# EAGLE design pbc (EAGLE 9.6.2)
CHECKED_BY: -; DRAWN_BY: Andreas Zapfl; REV: 1.0; TITLE: Business Card
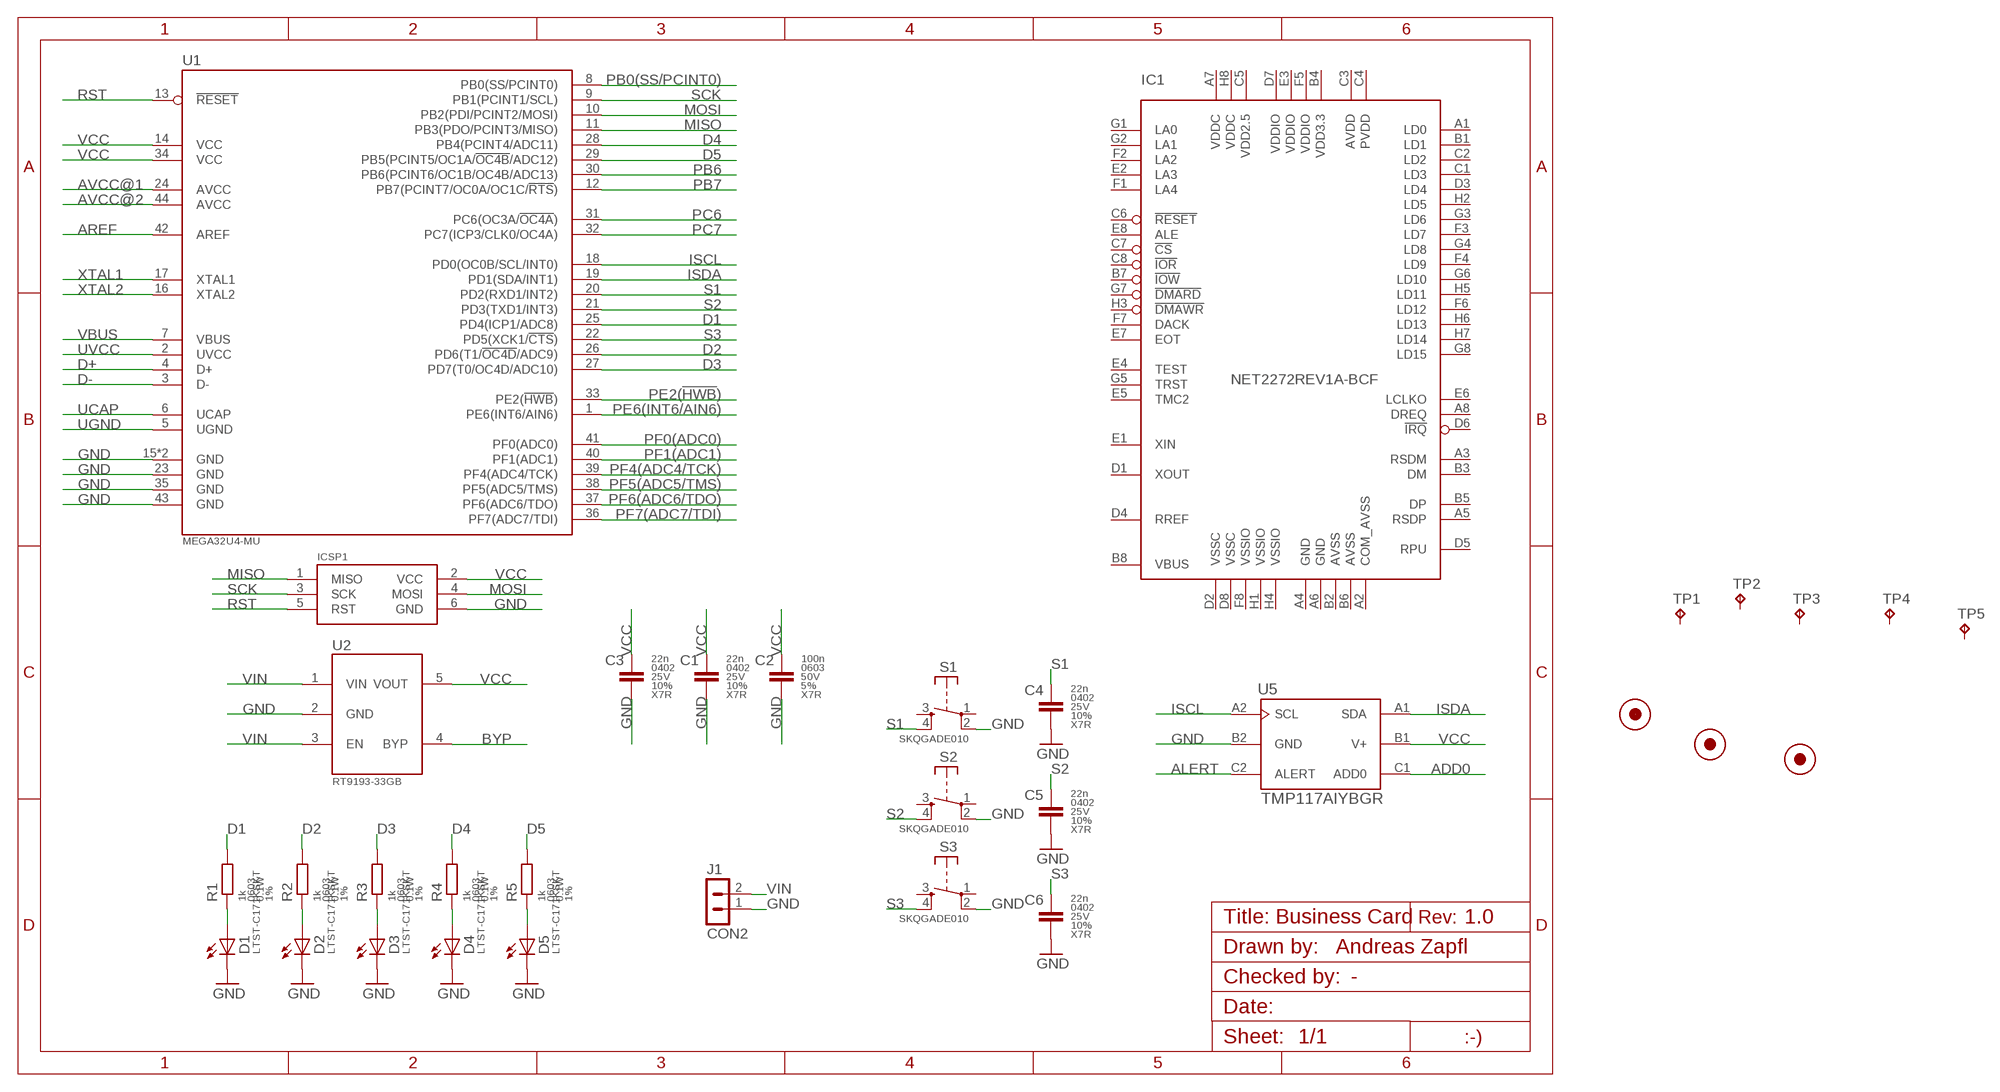
[diagram p0: schematic, sheet 1]

## Parts
C1  22n  22NF-0402-25V-10%  [C0402]
C2  100n  100NF-0603-50V-5%  [C0603]
C3  22n  22NF-0402-25V-10%  [C0402]
C4  22n  22NF-0402-25V-10%  [C0402]
C5  22n  22NF-0402-25V-10%  [C0402]
C6  22n  22NF-0402-25V-10%  [C0402]
D1  LTST-C171KSKT  [CHIPLED_0805]
D2  LTST-C171KSKT  [CHIPLED_0805]
D3  LTST-C171KSKT  [CHIPLED_0805]
D4  LTST-C171KSKT  [CHIPLED_0805]
D5  LTST-C171KSKT  [CHIPLED_0805]
FD1  FIDUCIAL  [FIDUCIAL_1MM]
FD2  FIDUCIAL  [FIDUCIAL_1MM]
FD3  FIDUCIAL  [FIDUCIAL_1MM]
IC1  NET2272REV1A-BCF  [FBGA64]
ICSP1  AVR-ISP-SKEDD  [490107670612_DEBUGGING]
J1  CON2  [H2-2.54]
R1  1k  1KOHM-0603-1/10W-1%  [R0603]
R2  1k  1KOHM-0603-1/10W-1%  [R0603]
R3  1k  1KOHM-0603-1/10W-1%  [R0603]
R4  1k  1KOHM-0603-1/10W-1%  [R0603]
R5  1k  1KOHM-0603-1/10W-1%  [R0603]
S1  SKQGADE010  [TACTILE_SWITCH_SMD_5.2MM]
S2  SKQGADE010  [TACTILE_SWITCH_SMD_5.2MM]
S3  SKQGADE010  [TACTILE_SWITCH_SMD_5.2MM]
TP1  TP-B0.635  [B0.635]
TP2  TP-B0.635  [B0.635]
TP3  TP-B0.635  [B0.635]
TP4  TP-B0.635  [B0.635]
TP5  TP-B0.635  [B0.635]
U1  MEGA32U4-MU  [TQFN44_7MM]
U2  RT9193-33GB  [SOT23-5]
U5  TMP117AIYBGR  [TMP117AIYBGR]

## Nets
ADD0: U5.C1(ADD0)
ALERT: U5.C2(ALERT)
AREF: U1.42(AREF)
AVCC@1: U1.24(AVCC)
AVCC@2: U1.44(AVCC)
BYP: U2.4(BYP)
D1: R1.2 U1.25(PD4(ICP1/ADC8))
D2: R2.2 U1.26(PD6(T1/!OC4D!/ADC9))
D3: R3.2 U1.27(PD7(T0/OC4D/ADC10))
D4: R4.2 U1.28(PB4(PCINT4/ADC11))
D5: R5.2 U1.29(PB5(PCINT5/OC1A/!OC4B!/ADC12))
D+: U1.4(D+)
D-: U1.3(D-)
GND: C1.2 C2.2 C3.2 C4.2 C5.2 C6.2 D1.C D2.C D3.C D4.C D5.C ICSP1.6(GND) J1.1 S1.2(P) S2.2(P) S3.2(P) U1.15(GND) U1.23(GND) U1.35(GND) U1.43(GND) U1.EXP(GND) U2.2(GND) U5.B2(GND)
ISCL: U1.18(PD0(OC0B/SCL/INT0)) U5.A2(SCL)
ISDA: U1.19(PD1(SDA/INT1)) U5.A1(SDA)
MISO: ICSP1.1(MISO) U1.11(PB3(PDO/PCINT3/MISO))
MOSI: ICSP1.4(MOSI) U1.10(PB2(PDI/PCINT2/MOSI))
N$1: D1.A R1.1
N$2: D2.A R2.1
N$3: D3.A R3.1
N$4: D4.A R4.1
N$5: D5.A R5.1
PB0(SS/PCINT0): U1.8(PB0(SS/PCINT0))
PB6: U1.30(PB6(PCINT6/OC1B/OC4B/ADC13))
PB7: U1.12(PB7(PCINT7/OC0A/OC1C/!RTS!))
PC6: U1.31(PC6(OC3A/!OC4A!))
PC7: U1.32(PC7(ICP3/CLK0/OC4A))
PE2(!HWB!): U1.33(PE2(!HWB!))
PE6(INT6/AIN6): U1.1(PE6(INT6/AIN6))
PF0(ADC0): U1.41(PF0(ADC0))
PF1(ADC1): U1.40(PF1(ADC1))
PF4(ADC4/TCK): U1.39(PF4(ADC4/TCK))
PF5(ADC5/TMS): U1.38(PF5(ADC5/TMS))
PF6(ADC6/TDO): U1.37(PF6(ADC6/TDO))
PF7(ADC7/TDI): U1.36(PF7(ADC7/TDI))
RST: ICSP1.5(RST) U1.13(!RESET!)
S1: C4.1 S1.4(S) U1.20(PD2(RXD1/INT2))
S2: C5.1 S2.4(S) U1.21(PD3(TXD1/INT3))
S3: C6.1 S3.4(S) U1.22(PD5(XCK1/!CTS!))
SCK: ICSP1.3(SCK) U1.9(PB1(PCINT1/SCL))
UCAP: U1.6(UCAP)
UGND: U1.5(UGND)
UVCC: U1.2(UVCC)
VBUS: U1.7(VBUS)
VCC: C1.1 C2.1 C3.1 ICSP1.2(VCC) U1.14(VCC) U1.34(VCC) U2.5(VOUT) U5.B1(V+)
VIN: J1.2 U2.1(VIN) U2.3(EN)
XTAL1: U1.17(XTAL1)
XTAL2: U1.16(XTAL2)
Unconnected: IC1.A1(LD0) IC1.A3(RSDM) IC1.A5(RSDP) IC1.A8(DREQ) IC1.B1(LD1) IC1.B3(DM) IC1.B5(DP) IC1.B7(!IOW) IC1.B8(VBUS) IC1.C1(LD3) IC1.C2(LD2) IC1.C6(!RESET) IC1.C7(!CS) IC1.C8(!IOR) IC1.D1(XOUT) IC1.D3(LD4) IC1.D4(RREF) IC1.D5(RPU) IC1.D6(!IRQ) IC1.E1(XIN) IC1.E2(LA3) IC1.E4(TEST) IC1.E5(TMC2) IC1.E6(LCLKO) IC1.E7(EOT) IC1.E8(ALE) IC1.F1(LA4) IC1.F2(LA2) IC1.F3(LD7) IC1.F4(LD9) IC1.F6(LD12) IC1.F7(DACK) IC1.G1(LA0) IC1.G2(LA1) IC1.G3(LD6) IC1.G4(LD8) IC1.G5(TRST) IC1.G6(LD10) IC1.G7(!DMARD) IC1.G8(LD15) IC1.H2(LD5) IC1.H3(!DMAWR) IC1.H5(LD11) IC1.H6(LD13) IC1.H7(LD14) S1.1(P) S1.3(S) S2.1(P) S2.3(S) S3.1(P) S3.3(S) TP1.TP TP2.TP TP3.TP TP4.TP TP5.TP

## Power pins joined to a net without a drawn wire
AVDD: IC1.C3(AVDD)
AVSS: IC1.B2(AVSS) IC1.B6(AVSS)
COM_AVSS: IC1.A2(COM_AVSS)
GND: IC1.A4(GND) IC1.A6(GND)
PVDD: IC1.C4(PVDD)
VDD2.5: IC1.C5(VDD2.5)
VDD3.3: IC1.B4(VDD3.3)
VDDC: IC1.A7(VDDC) IC1.H8(VDDC)
VDDIO: IC1.D7(VDDIO) IC1.E3(VDDIO) IC1.F5(VDDIO)
VSSC: IC1.D2(VSSC) IC1.D8(VSSC)
VSSIO: IC1.F8(VSSIO) IC1.H1(VSSIO) IC1.H4(VSSIO)

## Library data of the parts
C1 C3-C6 = zaan-Capacitors:22NF: 22nF capacitor; DESCRIPTION: Chip Capacitor; DIELECTRIC: X7R; MF: Wurth Electronics; MPN: 885012205052; PACKAGE: 1005; PACKAGE-IN: 0402; TOLERANCE: 10%; VOLTAGE: 25V
C2 = zaan-Capacitors:100NF: 100nF capacitor; DESCRIPTION: Chip Capacitor; DIELECTRIC: X7R; MF: Yageo; MPN: CC0603JRX7R9BB104; PACKAGE: 1606; PACKAGE-IN: 0603; TOLERANCE: 5%; VOLTAGE: 50V
D1-D5 = zaan-Optoelectronics:LTST: SMD LED Footprint: 0805 Source: Datasheet <http://optoelectronics.liteon.com/upload/download/ds22-2000-110/ltst-c171kskt.pdf> Manufacturer: Lite-On; DESCRIPTION: Surface Mount LED; MF: Lite-On; MPN: LTST-C171KSKT; PACKAGE: 2012; PACKAGE-IN: 0805
FD1-FD3 = EET-Symbols:FIDUCIAL: For use by pick and place machines to calibrate the vision/machine, 1mm
IC1 = plxtech:NET2272: NET2272 USB 2.0 Peripheral Controller Source: http://www.plxtech.com/dts/download.asp?f=NET2000/2272/Net2272.spec.re040615.pdf FBGA-Type: http://www1.plxtech.com/TEMP/77131/NET2272r1A_data_book_v1.92_31Oct05.pdf; OC_FARNELL: unknown; OC_NEWARK: unknown
ICSP1 = zaan-Connectors:AVR-ISP
J1 = zaan-Retired:CON2
R1-R5 = zaan-Resistors:1KOHM: 1kΩ resistor; DESCRIPTION: Chip Resistor; MF: Yageo; MPN: RC0603FR-071KL; PACKAGE: 1608; PACKAGE-IN: 0603; POWER: 0.1W; TOLERANCE: 1%; VOLTAGE: 75V
S1-S3 = zaan-Electromechanical:SKQGADE010
TP1-TP5 = EET-No-Category:TP
U1 = zaan-IC-Microcontroller:MEGA32U4: ATmega32u4 8-bit Microcontroller with 16/32K bytes of ISP Flash and USB Controller Footprint: QFN-44 Source: Datasheet <http://ww1.microchip.com/downloads/en/devicedoc/atmel-7766-8-bit-avr-atmega16u4-32u4_datasheet.pdf> Manufacturer: Atmel; DESCRIPTION: Microcontroller; MF: Atmel; MPN: ATMEGA32U4-MU; PACKAGE: QFN-44
U2 = zaan-IC-Power:RT9193: LDO Regulator 300mA, Ultra-Low Noise, Ultra-Fast CMOS LDO Regulator Footprint: SOT-23-5 Source: Datasheet <https://www.richtek.com/assets/product_file/RT9193/DS9193-16.pdf> Manufacturer: Richtek; DESCRIPTION: Low Dropout Regulator; MF: Richtek; MPN: RT9193-33GB; PACKAGE: SOT-23-5
U5 = Sensor:TMP117AIYBGR: TEMP SENSOR Manufacturer's datasheet <http://www.ti.com/lit/ds/symlink/tmp117.pdf>; CREATED_BY: PCBLayout.com; DIGIKEY_PART_NUMBER: 296-TMP117AIYBGRDKR-ND; MANUFACTURER: Texas Instruments; MPN: TMP117AIYBGR; PACKAGE: 6-DSBGA

## Board
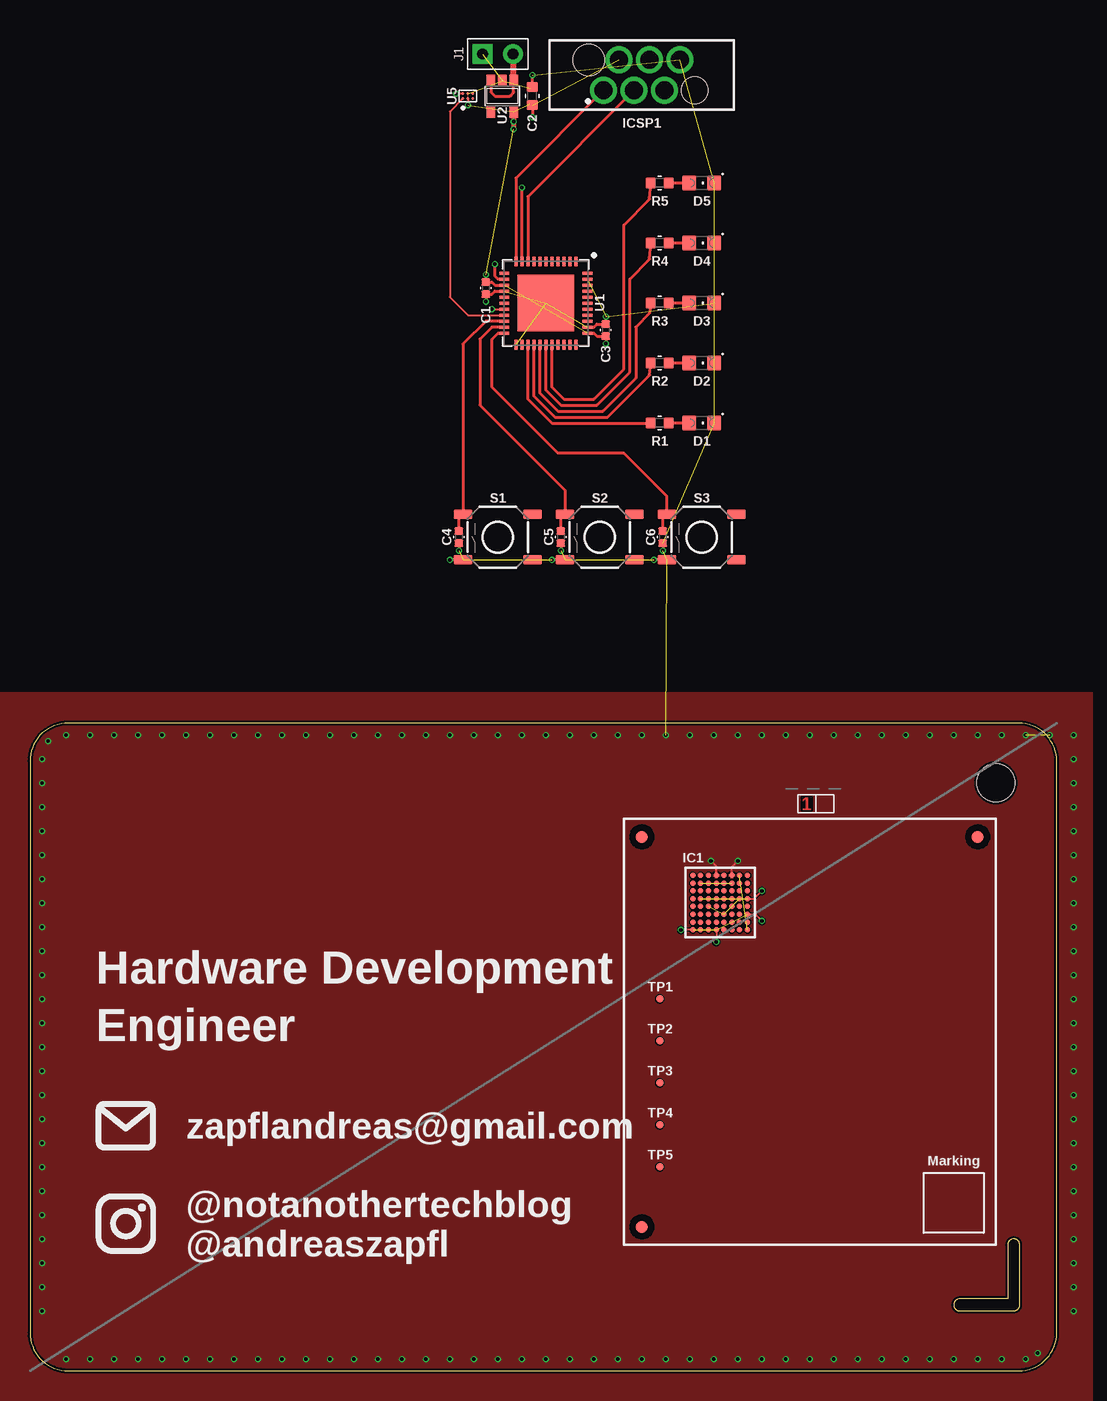
[diagram p1: board, top side]
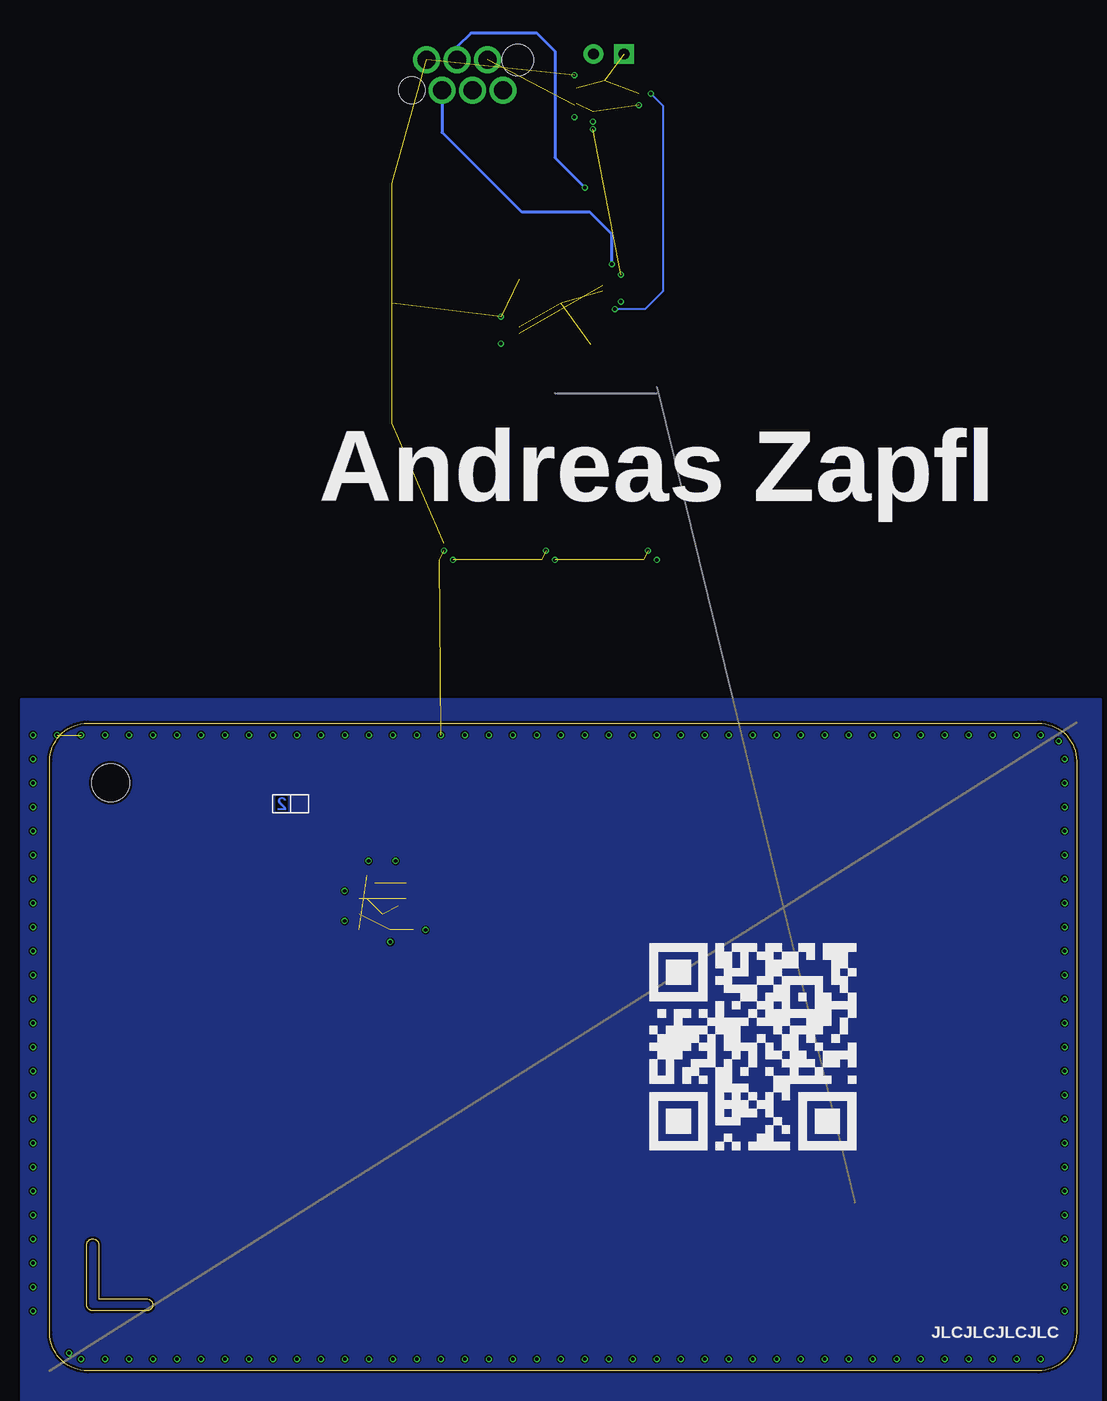
[diagram p2: board, bottom side, seen from below]

Size 85.6 x 53.98 mm. Coordinates in mm from the lower left corner, seen from the top.
Outline: 0,50.8 0,3.17 arc90 3.17,0 82.42,0 arc90 85.6,3.17 85.6,50.8 arc90 82.42,53.98 3.17,53.98 arc90 0,50.8
Outline: 77.52,6 arc180 77.52,5 82.02,5 arc90 82.52,5.5 82.52,10.5 arc180 81.52,10.5 81.52,6 77.52,6
Copper layers (1*16): Top 0.035mm / dielectric 1.44mm / Bottom 0.035mm
Design rules "Multi-CB_4L_EET *": minimum track width 0.1mm, minimum drill 0.2mm, track to track 0.1mm, track to pad 0.1mm, pad to pad 0.1mm, via to via 0.1mm, smd to smd 0mil, copper to edge 0.2mm, drill to drill 0.2mm, minimum pad ring 0.125mm, minimum via ring 0.1mm, stop-mask expansion 2mil, vias tented up to drill 0.45mm, thermal gap 0.2mm
Holes 3.17 mm at 80.52,49

### Footprints (pad centres in the part's own frame; a part is rotated, then mirrored left to right if it is on the bottom)
C0402 = smd 0.62 x 0.72: 1 -0.5,0; 2 0.5,0
C0603 = smd 0.85 x 0.95: 1 -0.75,0; 2 0.75,0
CHIPLED_0805 = smd 1.2 x 1.2: A 0,-1.05; C 0,1.05
FIDUCIAL_1MM = smd 1 x 1: 1 0,0
FBGA64 = smd 0.45 x 0.45: A1 -2.275,2.275; A2 -1.625,2.275; A3 -0.975,2.275; A4 -0.325,2.275; A5 0.325,2.275; A6 0.975,2.275; A7 1.625,2.275; A8 2.275,2.275; B1 -2.275,1.625; B2 -1.625,1.625; B3 -0.975,1.625; B4 -0.325,1.625; B5 0.325,1.625; B6 0.975,1.625; B7 1.625,1.625; B8 2.275,1.625; C1 -2.275,0.975; C2 -1.625,0.975; C3 -0.975,0.975; C4 -0.325,0.975; C5 0.325,0.975; C6 0.975,0.975; C7 1.625,0.975; C8 2.275,0.975; D1 -2.275,0.325; D2 -1.625,0.325; D3 -0.975,0.325; D4 -0.325,0.325; D5 0.325,0.325; D6 0.975,0.325; D7 1.625,0.325; D8 2.275,0.325; E1 -2.275,-0.325; E2 -1.625,-0.325; E3 -0.975,-0.325; E4 -0.325,-0.325; E5 0.325,-0.325; E6 0.975,-0.325; E7 1.625,-0.325; E8 2.275,-0.325; F1 -2.275,-0.975; F2 -1.625,-0.975; F3 -0.975,-0.975; F4 -0.325,-0.975; F5 0.325,-0.975; F6 0.975,-0.975; F7 1.625,-0.975; F8 2.275,-0.975; G1 -2.275,-1.625; G2 -1.625,-1.625; G3 -0.975,-1.625; G4 -0.325,-1.625; G5 0.325,-1.625; G6 0.975,-1.625; G7 1.625,-1.625; G8 2.275,-1.625; H1 -2.275,-2.275; H2 -1.625,-2.275; H3 -0.975,-2.275; H4 -0.325,-2.275; H5 0.325,-2.275; H6 0.975,-2.275; H7 1.625,-2.275; H8 2.275,-2.275
490107670612_DEBUGGING = drill 1.5 pad 1.825: 1 3.175,1.27; 2 1.905,-1.27; 3 0.635,1.27; 4 -0.635,-1.27; 5 -1.905,1.27; 6 -3.175,-1.27 | hole 2.2: -4.405,1.27 | hole 2.6: 4.405,-1.27
H2-2.54 = drill 0.889 pad 1.651 square: 1 0,1.27 | drill 0.889 pad 1.651: 2 0,-1.27
R0603 = smd 0.85 x 0.95: 1 -0.75,0; 2 0.75,0
TACTILE_SWITCH_SMD_5.2MM = smd 1.524 x 0.762: 1 -2.9,1.905; 2 2.9,1.905; 3 -2.9,-1.905; 4 2.9,-1.905
B0.635 = smd 0.635 x 0.635: TP 0,0
TQFN44_7MM = smd 0.8 x 0.25: 1 -3.475,2.5; 2 -3.475,2; 3 -3.475,1.5; 4 -3.475,1; 5 -3.475,0.5; 6 -3.475,0; 7 -3.475,-0.5; 8 -3.475,-1; 9 -3.475,-1.5; 10 -3.475,-2; 11 -3.475,-2.5; 23 3.475,-2.5; 24 3.475,-2; 25 3.475,-1.5; 26 3.475,-1; 27 3.475,-0.5; 28 3.475,0; 29 3.475,0.5; 30 3.475,1; 31 3.475,1.5; 32 3.475,2; 33 3.475,2.5 | smd 0.25 x 0.8: 12 -2.5,-3.475; 13 -2,-3.475; 14 -1.5,-3.475; 15 -1,-3.475; 16 -0.5,-3.475; 17 0,-3.475; 18 0.5,-3.475; 19 1,-3.475; 20 1.5,-3.475; 21 2,-3.475; 22 2.5,-3.475; 34 2.5,3.475; 35 2,3.475; 36 1.5,3.475; 37 1,3.475; 38 0.5,3.475; 39 0,3.475; 40 -0.5,3.475; 41 -1,3.475; 42 -1.5,3.475; 43 -2,3.475; 44 -2.5,3.475 | smd 4.7 x 4.7: EXP 0,0
SOT23-5 = smd 0.69 x 0.99: 1 -0.95,-1.29; 2 0,-1.29; 3 0.95,-1.29; 4 0.95,1.3; 5 -0.95,1.3
TMP117AIYBGR = smd 0.23 x 0.23: A1 -0.2,0.4; A2 0.2,0.4; B1 -0.2,0; B2 0.2,0; C1 -0.2,-0.4; C2 0.2,-0.4

### Placement (x,y rotation side)
C1  38,90.23 270 top  (outside the outline)
C2  41.88,106.23 90 top  (outside the outline)
C3  48,86.73 90 top  (outside the outline)
C4  35.75,69.48 270 top  (outside the outline)
C5  44.25,69.48 270 top  (outside the outline)
C6  52.75,69.48 270 top  (outside the outline)
D1  56,78.98 270 top  (outside the outline)
D2  56,83.98 270 top  (outside the outline)
D3  56,88.98 270 top  (outside the outline)
D4  56,93.98 270 top  (outside the outline)
D5  56,98.98 270 top  (outside the outline)
FD1  51.02,44.5 90 top
FD2  79.02,44.5 90 top
FD3  51.02,12 90 top
IC1  57.54,39.02 0 top
ICSP1  51,107.98 180 top  (outside the outline)
J1  39,109.73 90 top  (outside the outline)
R1  52.5,78.98 180 top  (outside the outline)
R2  52.5,83.98 180 top  (outside the outline)
R3  52.5,88.98 180 top  (outside the outline)
R4  52.5,93.98 180 top  (outside the outline)
R5  52.5,98.98 180 top  (outside the outline)
S1  39,69.48 180 top  (outside the outline)
S2  47.5,69.48 180 top  (outside the outline)
S3  56,69.48 180 top  (outside the outline)
TP1  52.52,31 0 top
TP2  52.52,27.5 0 top
TP3  52.52,24 0 top
TP4  52.52,20.5 0 top
TP5  52.52,17 0 top
U1  43,88.98 270 top  (outside the outline)
U2  39.38,106.23 180 top  (outside the outline)
U5  36.5,106.23 90 top  (outside the outline)
U$1  [JLC_UID]  6.79,3.23 180 bottom
U$2  [INSTA-5]  5.5,9.77 0 top
U$3  [MAIL-5]  5.5,18.39 0 top
U$4  [GITHUB-JRZ-20]  17,17.02 90 bottom
U$5  [STACKUP-2L]  65.52,47.25 0 top
U$6  [QR-SPACE]  77.02,14 0 top

### Tracks (layer width: path | path; a pad name or v marks a point on that pad's centre or on a via)
AVSS  (1 unrouted)
D1
  Top 0.254: R1.2 43.5,78.98 41.5,80.98 U1.25
D2
  Top 0.254: R2.2 51.65,82.98 48.15,79.48 43.75,79.48 42,81.23 U1.26
D3
  Top 0.254: R3.2 51.65,88.13 50.5,86.98 50.5,82.73 47.75,79.98 44,79.98 42.5,81.48 U1.27
D4
  Top 0.254: R4.2 51.65,92.63 50,90.98 50,83.23 47.25,80.48 44.25,80.48 43,81.73 U1.28
D5
  Top 0.254: R5.2 51.65,97.63 49.5,95.48 49.5,83.48 47,80.98 44.5,80.98 43.5,81.98 U1.29 | U1.29
GND  (via drill 0.3)  (22 unrouted)
  Top 0.152: IC1.A6 58.52,41.99 v59.02,42.5 | IC1.A4 57.22,42.05 v56.77,42.5
  Top 0.254: 41.68,106.88 C2.2 v41.88,107.98 | v38,89.11 C1.2 38.5,89.73 38.75,89.98 U1.15 | v48,87.86 C3.2 47.25,87.23 47,86.98 U1.35 | S1.2 v35,67.58 | S2.2 v43.5,67.58 | S3.2 v52,67.58 | C6.2 v52.75,68.36 | C5.2 v44.25,68.36 | C4.2 v35.75,68.36
  other vias: 87,4.98 84,1.48 83,0.98 81,0.98 79,0.98 77,0.98 75,0.98 73,0.98 71,0.98 69,0.98 67,0.98 65,0.98 63,0.98 61,0.98 59,0.98 57,0.98 55,0.98 53,0.98 51,0.98 49,0.98 47,0.98 45,0.98 43,0.98 41,0.98 39,0.98 37,0.98 35,0.98 33,0.98 31,0.98 29,0.98 27,0.98 25,0.98 23,0.98 21,0.98 19,0.98 17,0.98 15,0.98 13,0.98 11,0.98 9,0.98 7,0.98 5,0.98 3,0.98 1,4.98 1,6.98 1,8.98 1,10.98 1,12.98 1,14.98 1,16.98 1,18.98 1,20.98 1,22.98 1,24.98 1,26.98 1,28.98 1,30.98 1,32.98 1,34.98 1,36.98 1,38.98 1,40.98 1,42.98 1,44.98 1,46.98 1,48.98 1,50.98 1.5,52.48 3,52.98 5,52.98 7,52.98 9,52.98 11,52.98 13,52.98 15,52.98 17,52.98 19,52.98 21,52.98 23,52.98 25,52.98 27,52.98 29,52.98 31,52.98 33,52.98 35,52.98 37,52.98 39,52.98 41,52.98 43,52.98 45,52.98 47,52.98 49,52.98 51,52.98 53,52.98 55,52.98 57,52.98 59,52.98 61,52.98 63,52.98 65,52.98 67,52.98 69,52.98 71,52.98 73,52.98 75,52.98 77,52.98 79,52.98 81,52.98 83,52.98 85,52.98 87,52.98 87,50.98 87,48.98 87,46.98 87,44.98 87,42.98 87,40.98 87,38.98 87,36.98 87,34.98 87,32.98 87,30.98 87,28.98 87,26.98 87,24.98 87,22.98 87,20.98 87,18.98 87,16.98 87,14.98 87,12.98 87,10.98 87,8.98 87,6.98
  pour Top: 88.5,-3.52 -2.5,-3.52 -2.5,56.48 88.5,56.48
ISCL  (via drill 0.3)
  Top 0.152: U5.A2 v35.5,106.43 | v38.5,88.48 U1.18
  Bottom 0.152: v35.5,106.43 34.5,105.43 34.5,89.98 36,88.48 v38.5,88.48
ISDA
  Top 0.152: U5.A1 35,104.93 35,89.48 36.5,87.98 U1.19
MISO
  Top 0.254: U1.11 40.5,99.39 ICSP1.1
MOSI  (via drill 0.3)
  Top 0.254: U1.10 v41,98.61
  Bottom 0.254: ICSP1.4 51.64,110.34 50.5,111.48 45,111.48 43.5,109.98 43.5,101.11 v41,98.61
N$1
  Top 0.254: D1.A R1.1
N$2
  Top 0.254: D2.A R2.1
N$3
  Top 0.254: D3.A R3.1
N$4
  Top 0.254: D4.A R4.1
N$5
  Top 0.254: D5.A R5.1
RST  (via drill 0.3)
  Top 0.254: U1.13 39,90.98 38.75,91.23 v38.75,92.23
  Bottom 0.254: v38.75,92.23 38.75,94.73 40.58,96.56 46.25,96.56 52.91,103.21 ICSP1.5
S1
  Top 0.254: 36.1,71.48 36.1,85.58 38,87.48 U1.20 | 36.1,71.48 S1.4 | C4.1 35.75,71.13 36.1,71.48
S2
  Top 0.254: U1.21 38.5,86.98 37.5,85.98 37.5,80.48 44.6,73.38 44.6,71.48 | 44.6,71.48 S2.4 | C5.1 44.25,71.13 44.6,71.48
S3
  Top 0.254: S3.4 53.1,71.48 | 53.1,71.48 53.1,72.88 49.5,76.48 44,76.48 38.5,81.98 38.5,85.95 39.03,86.48 U1.22 | C6.1 52.75,71.13 53.1,71.48
SCK
  Top 0.254: ICSP1.3 41.5,97.84 U1.9
VCC  (via drill 0.3)  (5 unrouted)
  Top 0.152: U5.B1 v36.5,105.48
  Top 0.254: 41.68,105.58 C2.1 v41.88,104.48 | v38,91.36 C1.1 38.5,90.73 38.75,90.48 U1.14 | v48,85.61 C3.1 47.25,86.23 47,86.48 U1.34
  Top 0.406: U2.5 v40.33,104.11 v40.33,103.48
  pour Bottom: 88,55.98 -2,55.98 -2,-3.02 88,-3.02
VDDC  (1 unrouted)
VDDIO  (2 unrouted)
VIN
  Top 0.254: U2.3 38.43,106.56 38.75,106.23 40,106.23 40.33,106.56 U2.1
  Top 0.508: J1.2 40.27,109.72 40.33,109.66 U2.1
VSSC  (via drill 0.3)  (1 unrouted)
  Top 0.152: IC1.D8 60.37,39.34 v61.02,40
VSSIO  (via drill 0.3)  (2 unrouted)
  Top 0.152: IC1.H1 v54.27,36.74 | IC1.H4 v57.22,35.75 | IC1.F8 60.48,38.05 v61.02,37.5

### Text on the board
tNames: Hardware Development / Engineer | zapflandreas@gmail.com / / @notanothertechblog / @andreaszapfl | Info | V2.0
bNames: Andreas Zapfl
tStop: Andreas Zapfl
tDocu: ID-1: 85.6 x 53.98 mm, Radius: 3.175 mm